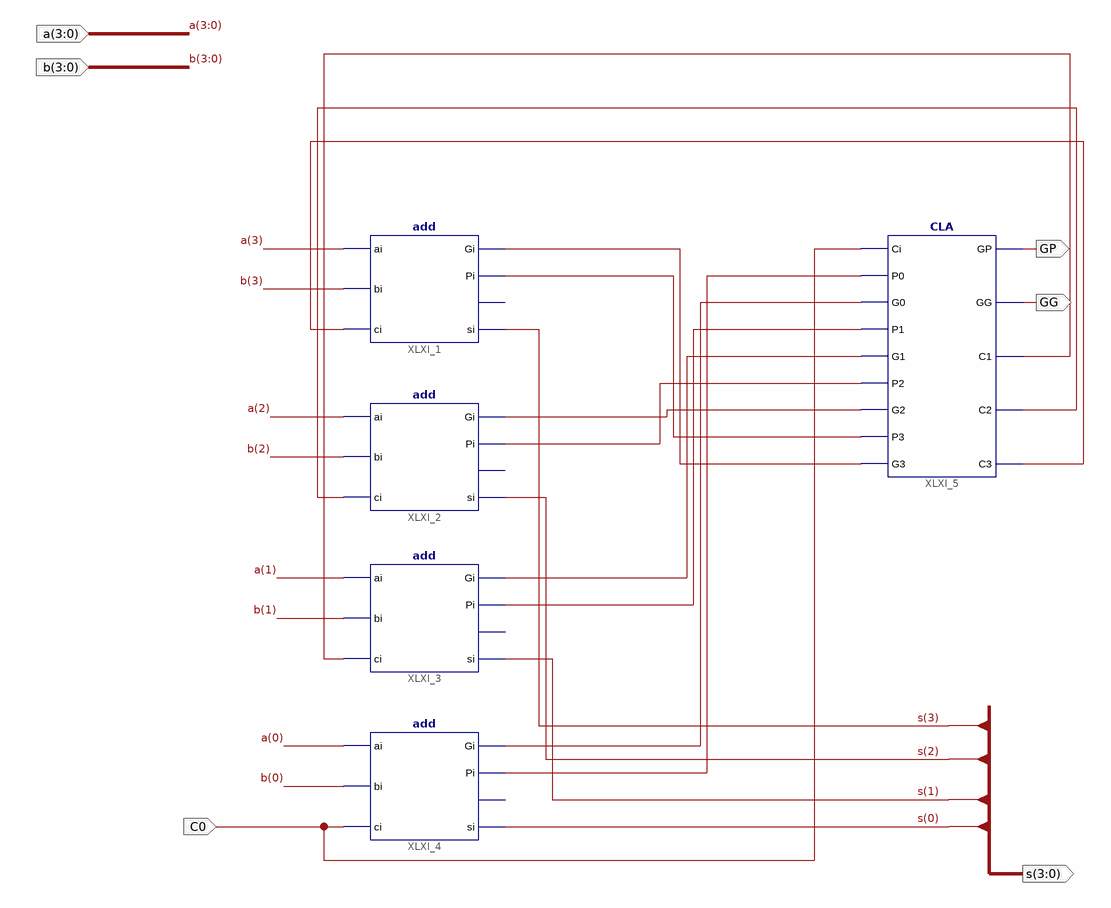
[diagram p0: schematic sheet 1]
// Xilinx ISE schematic ADD4b.sch (kintex7) as structural Verilog: 5 symbols, 6 ports
module ADD4b (
  input  C0,
  input  [3:0] a,
  input  [3:0] b,
  output GP,
  output GG,
  output [3:0] s
);

  wire XLXN_5, XLXN_6, XLXN_7, XLXN_19, XLXN_20, XLXN_22, XLXN_23, XLXN_25, XLXN_27, XLXN_28, XLXN_29;

  add XLXI_1 (.ai(a[3]), .bi(b[3]), .ci(XLXN_5), .Gi(XLXN_19), .Pi(XLXN_20), .si(s[3]));  // open: co
  add XLXI_2 (.ai(a[2]), .bi(b[2]), .ci(XLXN_6), .Gi(XLXN_22), .Pi(XLXN_23), .si(s[2]));  // open: co
  add XLXI_3 (.ai(a[1]), .bi(b[1]), .ci(XLXN_7), .Gi(XLXN_25), .Pi(XLXN_27), .si(s[1]));  // open: co
  add XLXI_4 (.ai(a[0]), .bi(b[0]), .ci(C0), .Gi(XLXN_28), .Pi(XLXN_29), .si(s[0]));  // open: co
  CLA XLXI_5 (
    .Ci(C0), .P0(XLXN_29), .G0(XLXN_28), .P1(XLXN_27), .G1(XLXN_25), .P2(XLXN_23), .G2(XLXN_22),
    .P3(XLXN_20), .G3(XLXN_19), .GP(GP), .GG(GG), .C1(XLXN_7), .C2(XLXN_6), .C3(XLXN_5));
endmodule
